# Altium project BLE_Gateway_V1.0.PrjPCB
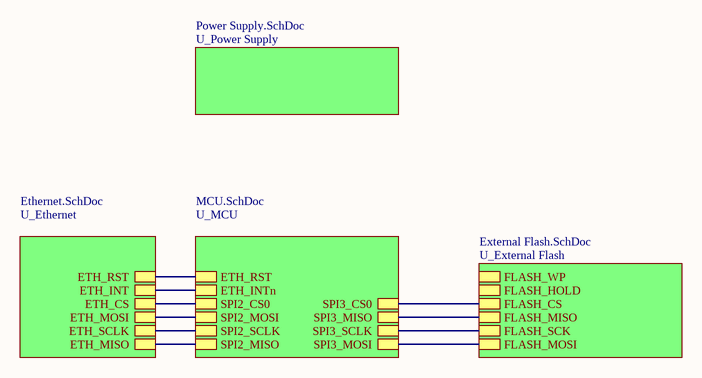
[diagram p0: Connection.SchDoc]
5 sheets, 108 parts. Net scope: hierarchical (ports join the sheet entries above them; power ports are global).
Board files: SHD2ZW2v1.2.1.PcbDoc, Logo.PcbDoc
Sheets:
  Connection.SchDoc
    U_MCU = MCU.SchDoc
    U_Ethernet = Ethernet.SchDoc
    U_Power Supply = Power Supply.SchDoc
    U_External Flash = External Flash.SchDoc

## Sheet Connection.SchDoc
size 381 x 241 mm

### Sub-sheets
U_Ethernet = Ethernet.SchDoc: ETH_MISO, ETH_MOSI, ETH_CS, ETH_INT, ETH_RST, ETH_SCLK
U_External Flash = External Flash.SchDoc: FLASH_CS, FLASH_MISO, FLASH_WP, FLASH_HOLD, FLASH_SCK, FLASH_MOSI
U_MCU = MCU.SchDoc: SPI3_MOSI, SPI3_MISO, SPI3_SCLK, SPI3_CS0, SPI2_CS0, SPI2_MOSI, SPI2_SCLK, SPI2_MISO, ETH_RST, ETH_INTn
U_Power Supply = Power Supply.SchDoc: no entries

### Nets
RSTn: sheet U_MCU/ETH_RST, sheet U_Ethernet/ETH_RST
SPI2_CS0: sheet U_MCU/SPI2_CS0, sheet U_Ethernet/ETH_CS
SPI2_MISO: sheet U_MCU/SPI2_MISO, sheet U_Ethernet/ETH_MISO
SPI2_MOSI: sheet U_MCU/SPI2_MOSI, sheet U_Ethernet/ETH_MOSI
SPI2_SCLK: sheet U_MCU/SPI2_SCLK, sheet U_Ethernet/ETH_SCLK
SPI3_CS0: sheet U_MCU/SPI3_CS0, sheet U_External Flash/FLASH_CS
SPI3_MISO: sheet U_MCU/SPI3_MISO, sheet U_External Flash/FLASH_MISO
SPI3_MOSI: sheet U_MCU/SPI3_MOSI, sheet U_External Flash/FLASH_MOSI
SPI3_SCLK: sheet U_MCU/SPI3_SCLK, sheet U_External Flash/FLASH_SCK
NetU2_11: sheet U_MCU/ETH_INTn, sheet U_Ethernet/ETH_INT

## Sheet MCU.SchDoc
size 304 x 241 mm
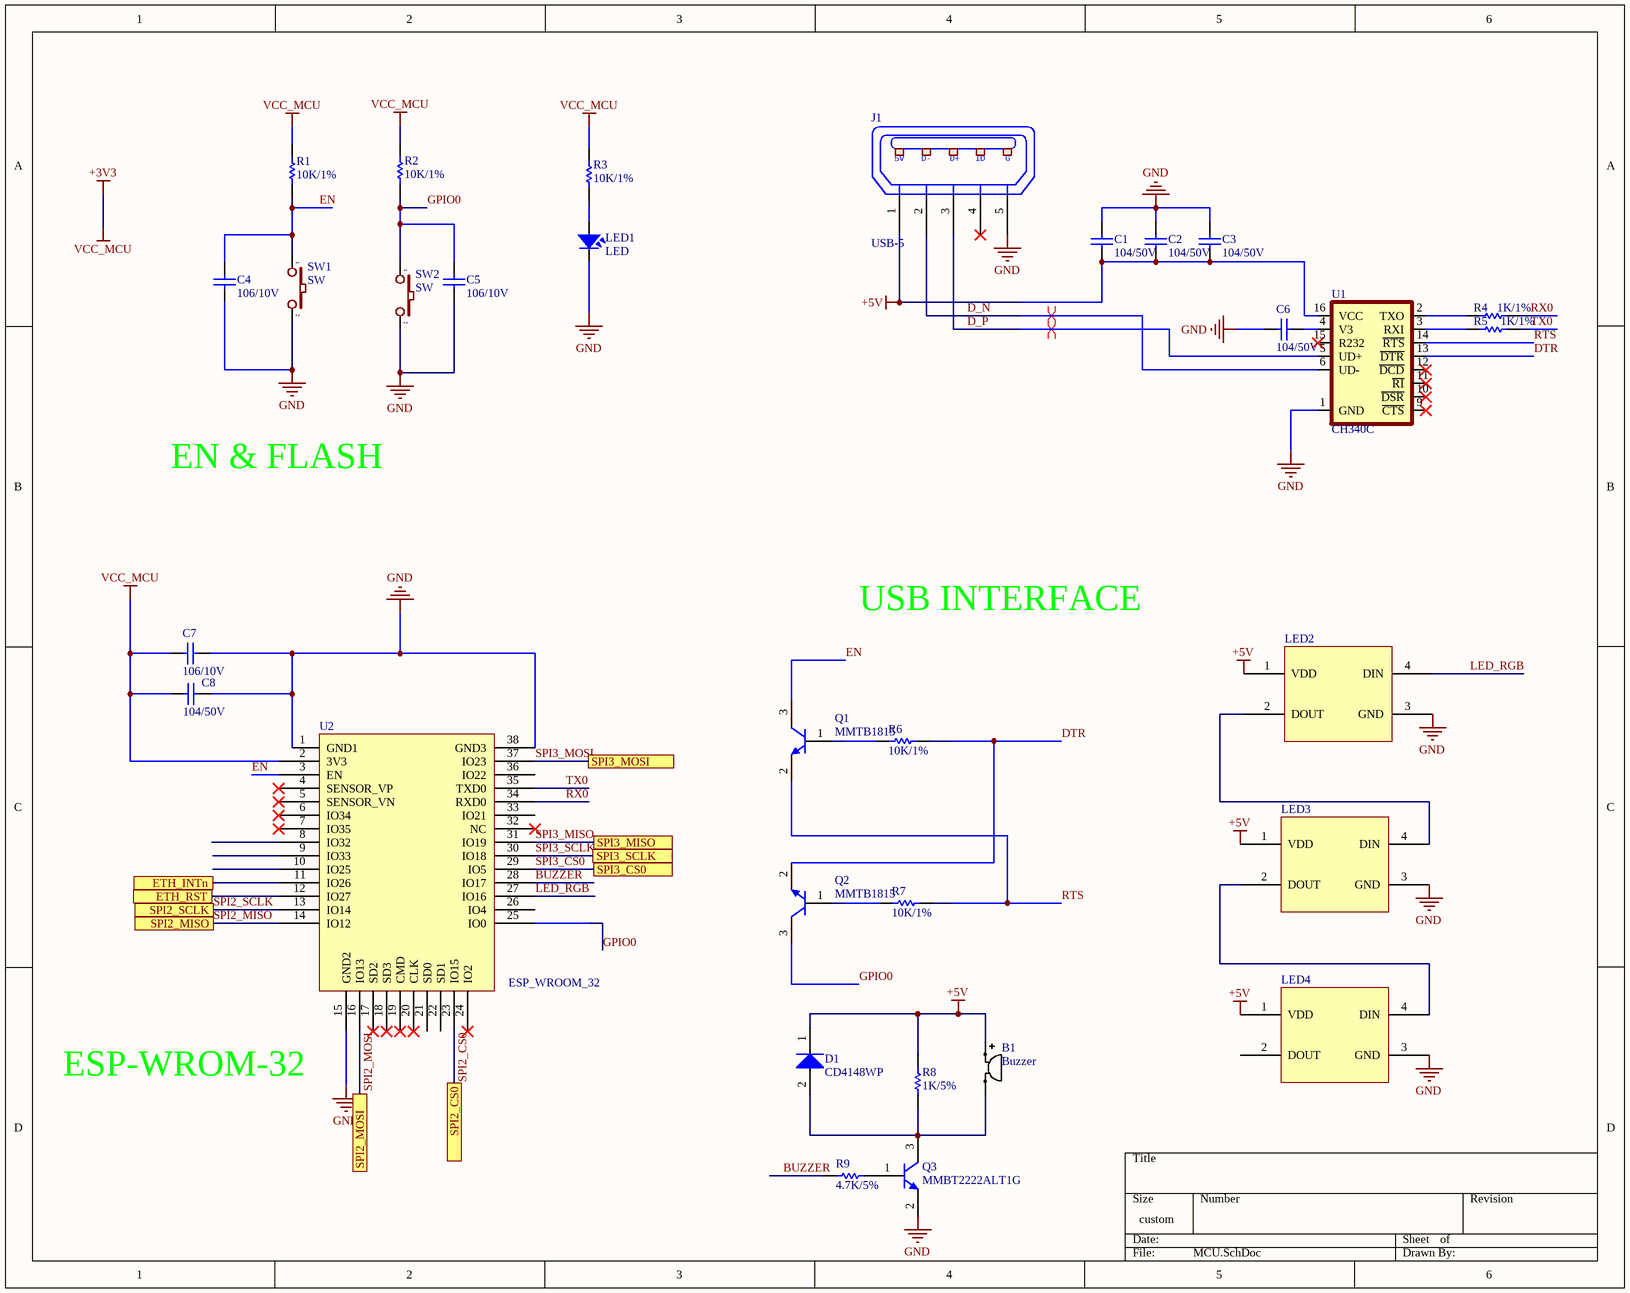
[diagram p1: MCU.SchDoc]

### Parts
B1  Buzzer  [PS1240P02BT]
C1  104/50V  [C0603-B]
C2  104/50V  [C0603-B]
C3  104/50V  [C0603-B]
C4  106/10V  [C0603-B]
C5  106/10V  [C0603-B]
C6  104/50V  [C0603-B]
C7  106/10V  [C0603-B]
C8  104/50V  [C0603-B]
D1  CD4148WP  [D1206-C]
J1  USB-5  [USB-M1]
LED1  LED  [LED-0805-Red]
LED2  RGB 4 Pin WS2812B  [WS2812B]  (value not drawn)
LED3  RGB 4 Pin WS2812B  [WS2812B]  (value not drawn)
LED4  RGB 4 Pin WS2812B  [WS2812B]  (value not drawn)
Q1  MMTB1815  [SOT23-321-C]
Q2  MMTB1815  [SOT23-321-C]
Q3  MMBT2222ALT1G  [SOT23-321-B]
R1  10K/1%  [R0603-B]
R2  10K/1%  [R0603-B]
R3  10K/1%  [R0603-B]
R4  1K/1%  [R0603-B]
R5  1K/1%  [R0603-B]
R6  10K/1%  [R0603-B]
R7  10K/1%  [R0603-B]
R8  1K/5%  [R0603-B]
R9  4.7K/5%  [R0603-B]
SW1  SW  [SW2 - 3x4x2.5]
SW2  SW  [SW2 - 3x4x2.5]
U1  CH340C  [SO016]
U2  ESP_WROOM_32  [ESP32_WROOM_32]

### Ports
ETH_INTn, ETH_RST, SPI2_CS0, SPI2_MISO, SPI2_MOSI, SPI2_SCLK, SPI3_CS0, SPI3_MISO, SPI3_MOSI, SPI3_SCLK

### Nets
+3V3: C7.2 C8.2 R1.2 R2.2 R3.2 U2.2(3V3)  [also labelled VCC_MCU]
+5V: B1.1 C1.1 C2.1 C3.1 D1.1(K) J1.1(P1) LED2.1(VDD) LED3.1(VDD) LED4.1(VDD) R8.2 U1.16(VCC)
GND: C1.2 C2.2 C3.2 C4.1 C5.1 C6.2 C7.1 C8.1 J1.5(P5) LED1.2 LED2.3(GND) LED3.3(GND) LED4.3(GND) Q3.2(E) SW1.2 SW2.2 U1.1(GND) U2.1(GND1) U2.15(GND2) U2.38(GND3)
BUZZER: R9.1 U2.28(IO17)
D_N: J1.2(P2) U1.6(UD-)
D_P: J1.3(P3) U1.5(UD+)
DTR: Q2.2(E) R6.2 U1.13(~{DTR})
EN: C4.2 Q1.3(C) R1.1 SW1.1 U2.3(EN)
GPIO0: C5.2 Q2.3(C) R2.1 SW2.1 U2.25(IO0)
LED_RGB: LED2.4(DIN) U2.27(IO16)
RSTn: U2.12(IO27) ; port ETH_RST
RTS: Q1.2(E) R7.2 U1.14(~{RTS})
RX0: R4.2 U2.34(RXD0)
SPI2_CS0: U2.23(IO15) ; port SPI2_CS0
SPI2_MISO: U2.14(IO12) ; port SPI2_MISO
SPI2_MOSI: U2.16(IO13) ; port SPI2_MOSI
SPI2_SCLK: U2.13(IO14) ; port SPI2_SCLK
SPI3_CS0: U2.29(IO5) ; port SPI3_CS0
SPI3_MISO: U2.31(IO19) ; port SPI3_MISO
SPI3_MOSI: U2.37(IO23) ; port SPI3_MOSI
SPI3_SCLK: U2.30(IO18) ; port SPI3_SCLK
TX0: R5.2 U2.35(TXD0)
NetB1_2: B1.2 D1.2(A) Q3.3(C) R8.1
NetC6_1: C6.1 U1.4(V3)
NetLED1_1: LED1.1 R3.1
NetLED2_2: LED2.2(DOUT) LED3.4(DIN)
NetLED3_2: LED3.2(DOUT) LED4.4(DIN)
NetQ1_1: Q1.1(B) R6.1
NetQ2_1: Q2.1(B) R7.1
NetQ3_1: Q3.1(B) R9.2
NetR4_1: R4.1 U1.2(TXO)
NetR5_1: R5.1 U1.3(RXI)
NetU2_11: U2.11(IO26) ; port ETH_INTn

Not connected (* = marked no-connect by the designer): J1 4(P4)*; LED4 2(DOUT); U1 9(~{CTS})* 10(~{DSR})* 11(~{RI})* 12(~{DCD})* 15(R232)*; U2 4(SENSOR_VP)* 5(SENSOR_VN)* 6(IO34)* 7(IO35)* 8(IO32) 9(IO33) 10(IO25) 17(SD2)* 18(SD3)* 19(CMD)* 20(CLK)* 21(SD0) 22(SD1) 24(IO2)* 26(IO4) 32(NC)* 33(IO21) 36(IO22)

### Layout directives
differential pair: D_N, D_P

### Notes on the sheet
- EN & FLASH
- USB INTERFACE
- ESP-WROM-32
- (in symbol USB-5) 5V; D-; D+; ID; G

### Library data of the parts
B1 = PS1240P02BT: Audio Indicators & Alerts Round 12.2mmx6.5mm 4kHz Vin=3V; BSH Partnumber: New part; Manufacture: TDK; Pricing (USD): 0.78; Partnumber: PS1240P02BT; Distributor: Digikey; Value: Buzzer; Creator: NamNHc; Date: 20170410; ComponentLink1Description: Datasheet; ComponentLink1URL: https://product.tdk.com/info/en/catalog/datasheets/ef532_ps.pdf; Datasheet: https://product.tdk.com/info/en/catalog/datasheets/ef532_ps.pdf; ComponentLink2Description: Link sale; ComponentLink2URL: https://www.digikey.com/product-detail/en/tdk-corporation/PS1240P02BT/445-2525-3-ND/935924; Link sale: https://www.digikey.com/product-detail/en/tdk-corporation/PS1240P02BT/445-2525-3-ND/935924
C1-C3 C6 C8 = CL10B104KB8NNNC: 100nF ±10% 50V X7R 0603 Multilayer Ceramic Capacitors MLCC - SMD/SMT RoHS; BSH Partnumber: C1591; Manufacture: Samsung Electro-Mechanics; Pricing (USD): 0.008; Partnumber: CL10B104KB8NNNC; Distributor: LCSC Electronics; Value: 104/50V; Creator: Digo; Date: 20210218; ComponentLink1Description: Datasheet; ComponentLink1URL: https://datasheet.lcsc.com/szlcsc/1811021431_Samsung-Electro-Mechanics-CL10B104KB8NNNC_C1591.pdf; Datasheet: https://datasheet.lcsc.com/szlcsc/1811021431_Samsung-Electro-Mechanics-CL10B104KB8NNNC_C1591.pdf; ComponentLink2Description: Link sale; ComponentLink2URL: https://item.szlcsc.com/1943.html; Link sale: https://item.szlcsc.com/1943.html
C4 C5 C7 = CL10A106KP8NNNC: 10uF ±10% 10V X5R 0603 Multilayer Ceramic Capacitors MLCC - SMD/SMT RoHS; BSH Partnumber: C19702; Manufacture: Samsung Electro-Mechanics; Pricing (USD): 0.008; Partnumber: CL10A106KP8NNNC; Distributor: LCSC Electronics; Value: 106/10V; Creator: Digo; Date: 20210219; ComponentLink1Description: Datasheet; ComponentLink1URL: https://datasheet.lcsc.com/szlcsc/1810191219_Samsung-Electro-Mechanics-CL10A106KP8NNNC_C19702.pdf; Datasheet: https://datasheet.lcsc.com/szlcsc/1810191219_Samsung-Electro-Mechanics-CL10A106KP8NNNC_C19702.pdf; ComponentLink2Description: Link sale; ComponentLink2URL: https://item.szlcsc.com/20411.html; Link sale: https://item.szlcsc.com/20411.html
D1 = CD4148WP: DIO D1206 150mA 75V Switching Chip Diode; BSH Partnumber: D-CD4148WP; Manufacture: Mayloon electronic; Pricing (USD): 0.029; Partnumber: CD4148WP; Value: CD4148WP; Creator: ChienNQ; Date: 20150818; ComponentLink1Description: Datasheet; ComponentLink1URL: http://www.mouser.com/ds/2/115/ds18004-73542.pdf; Datasheet: http://www.mouser.com/ds/2/115/ds18004-73542.pdf; ComponentLink2Description: Link sale; ComponentLink2URL: http://tme.vn/Product.aspx?id=1848; Link sale: http://tme.vn/Product.aspx?id=1848
J1 = USB-5: Manufacturer: FCI; Manufacturer Part Number: 10118193-0001LF; Connector Type: USB - micro B; Number of Contacts: 5; Gender: Receptacle; Specifications: USB 2.0; .Creator: MM; .Checked PCB: RF; Supplier 1: Digi-Key; RoHS: RoHS Compliant; Category: Connectors, Interconnects; Stock 1: 28642; Pricing 1: 1=0.46, 10=0.433, 25=0.3712, 50=0.3156, 100=0.3032, 250=0.27224, 500=0.25988 (USD); Packaging: Cut Tape (CT); Mounting Type: Surface Mount, Right Angle, Horizontal; Features: Shielded, Solder Retention; Ingress Protection: -; ComponentLink1URL: http://portal.fciconnect.com/Comergent//fci/drawing/10118193.pdf; ComponentLink1Description: http://portal.fciconnect.com/Comergent//fci/drawing/10118193.pdf; Supplier Part Number 1: 609-4616-1-ND; .Checked SCH: MM
LED1 = LED: LED Single colour Green and Red; Value: LED 3 ly Single Colour
LED2-LED4 = WS2812B: Intelligent control LED / integrated light source
Q1 Q2 = MMTB1815: Transistor NPN SOT23 MMTB1815 Pitch_0.90 mm 2.92x2.00x1.11 mm; BSH Partnumber: Q-MMBT1815-TP; Manufacture: Toshiba; Pricing (USD): 0.025; Partnumber: MMTB1815; Value: MMTB1815; Creator: DucNTc; Date: 20150912; ComponentLink1Description: Datasheet; ComponentLink1URL: http://www.cnelectr.net/diodes/pdf/mmbt1815.pdf; Datasheet: http://www.cnelectr.net/diodes/pdf/mmbt1815.pdf; ComponentLink2Description: Link sale; ComponentLink2URL: http://www.tme.vn/Product.aspx?id=413; Link sale: http://www.tme.vn/Product.aspx?id=413
Q3 = MMBT2222ALT1G: Transistor NPN SOT23 MMBT2222A Pitch_0.90 mm 2.92x2.00x1.11mm; BSH Partnumber: Q-MMBT2222A; Manufacture: Fairchild Semiconductor; Pricing (USD): 0.02; Partnumber: MMBT2222ALT1G; Distributor: Mouser; Value: MMBT2222ALT1G; Creator: SmartDevice; Date: 20150923; ComponentLink1Description: Datasheet; ComponentLink1URL: http://www.mouser.com/ds/2/308/MMBT2222LT1-D-80103.pdf; Datasheet: http://www.mouser.com/ds/2/308/MMBT2222LT1-D-80103.pdf; ComponentLink2Description: Link sale; ComponentLink2URL: http://www.mouser.vn/ProductDetail/ON-Semiconductor/MMBT2222ALT1G/?qs=sGAEpiMZZMutXGli8Ay4kC402l06AIhPIMD2ii7BaQ0%3d; Link sale: http://www.mouser.vn/ProductDetail/ON-Semiconductor/MMBT2222ALT1G/?qs=sGAEpiMZZMutXGli8Ay4kC402l06AIhPIMD2ii7BaQ0%3d
R1-R3 R6 R7 = RC0603FR-0710KL: RES 0603 10K 1% 100mW; BSH Partnumber: C98220; Manufacture: Yageo; Pricing (USD): 0.002; Partnumber: RC0603FR-0710KL; Distributor: LCSC Electronics; Value: 10K/1%; Creator: Digo; Date: 20181029; ComponentLink1Description: Datasheet; ComponentLink1URL: https://datasheet.lcsc.com/lcsc/1811101934_YAGEO-RC0603FR-0710KL_C98220.pdf; Datasheet: https://datasheet.lcsc.com/lcsc/1811101934_YAGEO-RC0603FR-0710KL_C98220.pdf; ComponentLink2Description: Link sale; ComponentLink2URL: https://item.szlcsc.com/99429.html; Link sale: https://item.szlcsc.com/99429.html
R4 R5 = RC0603FR-071KL: RES 0603 1K 1% 100mW; BSH Partnumber: R-1k-0603-1; Manufacture: Yageo; Pricing (USD): 0.002; Partnumber: RC0603FR-071KL; Distributor: Mouser; Value: 1K/1%; Creator: SmartDevice; Date: 20150818; ComponentLink1Description: Datasheet; ComponentLink1URL: http://www.mouser.com/ds/2/447/RC0603-272842.pdf; Datasheet: http://www.mouser.com/ds/2/447/RC0603-272842.pdf; ComponentLink2Description: Link sale; ComponentLink2URL: http://vn.mouser.com/ProductDetail/Yageo/RC0603FR-071KL/?qs=%2fha2pyFaduhXXNW8qwNUNqQ9kEEY7HXXvpzZHS3Y0h%2feQEDxZMSpaQ%3d%3d; Link sale: http://vn.mouser.com/ProductDetail/Yageo/RC0603FR-071KL/?qs=%2fha2pyFaduhXXNW8qwNUNqQ9kEEY7HXXvpzZHS3Y0h%2feQEDxZMSpaQ%3d%3d
R8 = RC0603JR-071KL: RES 0603 1K 5% 100mW; BSH Partnumber: R-1K-0603-5; Manufacture: Yageo; Pricing (USD): 0.002; Partnumber: RC0603JR-071KL; Distributor: Mouser; Value: 1K/5%; Creator: SmartDevice; Date: 20160721; ComponentLink1Description: Datasheet; ComponentLink1URL: http://www.mouser.com/ds/2/447/RC0603-272842.pdf; Datasheet: http://www.mouser.com/ds/2/447/RC0603-272842.pdf; ComponentLink2Description: Link sale; ComponentLink2URL: http://www.mouser.vn/ProductDetail/Yageo/RC0603JR-071KL/?qs=%2fha2pyFaduiI%252b%2f%2fp%2fYhTTYiezRJ8nHxshEHwOaiSZf9t3tyz6IYSbg%3d%3d; Link sale: http://www.mouser.vn/ProductDetail/Yageo/RC0603JR-071KL/?qs=%2fha2pyFaduiI%252b%2f%2fp%2fYhTTYiezRJ8nHxshEHwOaiSZf9t3tyz6IYSbg%3d%3d
R9 = RC0603JR-074K7L: RES 0603 4K7 5% 100mW; BSH Partnumber: R-4K7-0603-5; Manufacture: Yageo; Pricing (USD): 0.002; Partnumber: RC0603JR-074K7L; Distributor: Mouser; Value: 4.7K/5%; Creator: SmartDevice; Date: 20150818; ComponentLink1Description: Datasheet; ComponentLink1URL: http://www.mouser.com/ds/2/447/RC0603-272842.pdf; Datasheet: http://www.mouser.com/ds/2/447/RC0603-272842.pdf; ComponentLink2Description: Link sale; ComponentLink2URL: http://vn.mouser.com/ProductDetail/Yageo/RC0603JR-074K7L/?qs=sGAEpiMZZMu61qfTUdNhG5eFuApKbqVdnRFv6b%2fvKA4%3d; Link sale: http://vn.mouser.com/ProductDetail/Yageo/RC0603JR-074K7L/?qs=sGAEpiMZZMu61qfTUdNhG5eFuApKbqVdnRFv6b%2fvKA4%3d
SW1 SW2 = SW2: Switch button 2 pin; Value: SW chip 2 pin
U1 = CH340C: USB to serial chip CH340; MF: WCH; Package: Package; Check_prices: https://www.snapeda.com/parts/CH340C/WCH/view-part/5428851/?ref=eda; Value: *; Price: None; MP: CH340C; Availability: Unavailable; SnapEDA_Link: https://www.snapeda.com/parts/CH340C/WCH/view-part/5428851/?ref=snap; ComponentLink1Description: https://shopee.vn/10-Ic-Ch340C-Ch340-Sop-16-Ic-Ch%E1%BA%A5t-L%C6%B0%E1%BB%A3ng-Cao-i.354017206.3568923182?gclid=CjwKCAjwgviIBhBkEiwA10D2jxg9RuL2f9hWoYHeo_FSM6pspJ3WHd-aH4B39ByWSgvqeA63UJxyaRoCPFwQAvD_BwE; ComponentLink1URL: https://shopee.vn/10-Ic-Ch340C-Ch340-Sop-16-Ic-Ch%E1%BA%A5t-L%C6%B0%E1%BB%A3ng-Cao-i.354017206.3568923182?gclid=CjwKCAjwgviIBhBkEiwA10D2jxg9RuL2f9hWoYHeo_FSM6pspJ3WHd-aH4B39ByWSgvqeA63UJxyaRoCPFwQAvD_BwE; ComponentLink2Description: https://shopee.vn/IC-giao-ti%E1%BA%BFp-USB-UART-CH340C-i.211729822.6315362497; ComponentLink2URL: https://shopee.vn/IC-giao-ti%E1%BA%BFp-USB-UART-CH340C-i.211729822.6315362497
U2 = ESP_WROOM_32: Manufacturer: Espressif Systems; Manufacturer Part Number: ESP32-WROOM-32E(4MBHIGHTEMP); Supplier 1: Digi-Key; Stock 1: 0; Pricing 1: 1=3.15 (USD); Supplier Part Number 1: 1965-ESP32-WROOM-32E(4MBHIGHTEMP)CT-ND; ComponentLink1Description: https://banlinhkien.vn/goods-9735-esp32-wroom-32-esp32-soc-chinh-hang.html; ComponentLink1URL: https://banlinhkien.vn/goods-9735-esp32-wroom-32-esp32-soc-chinh-hang.html

## Sheet Ethernet.SchDoc
size 381 x 241 mm
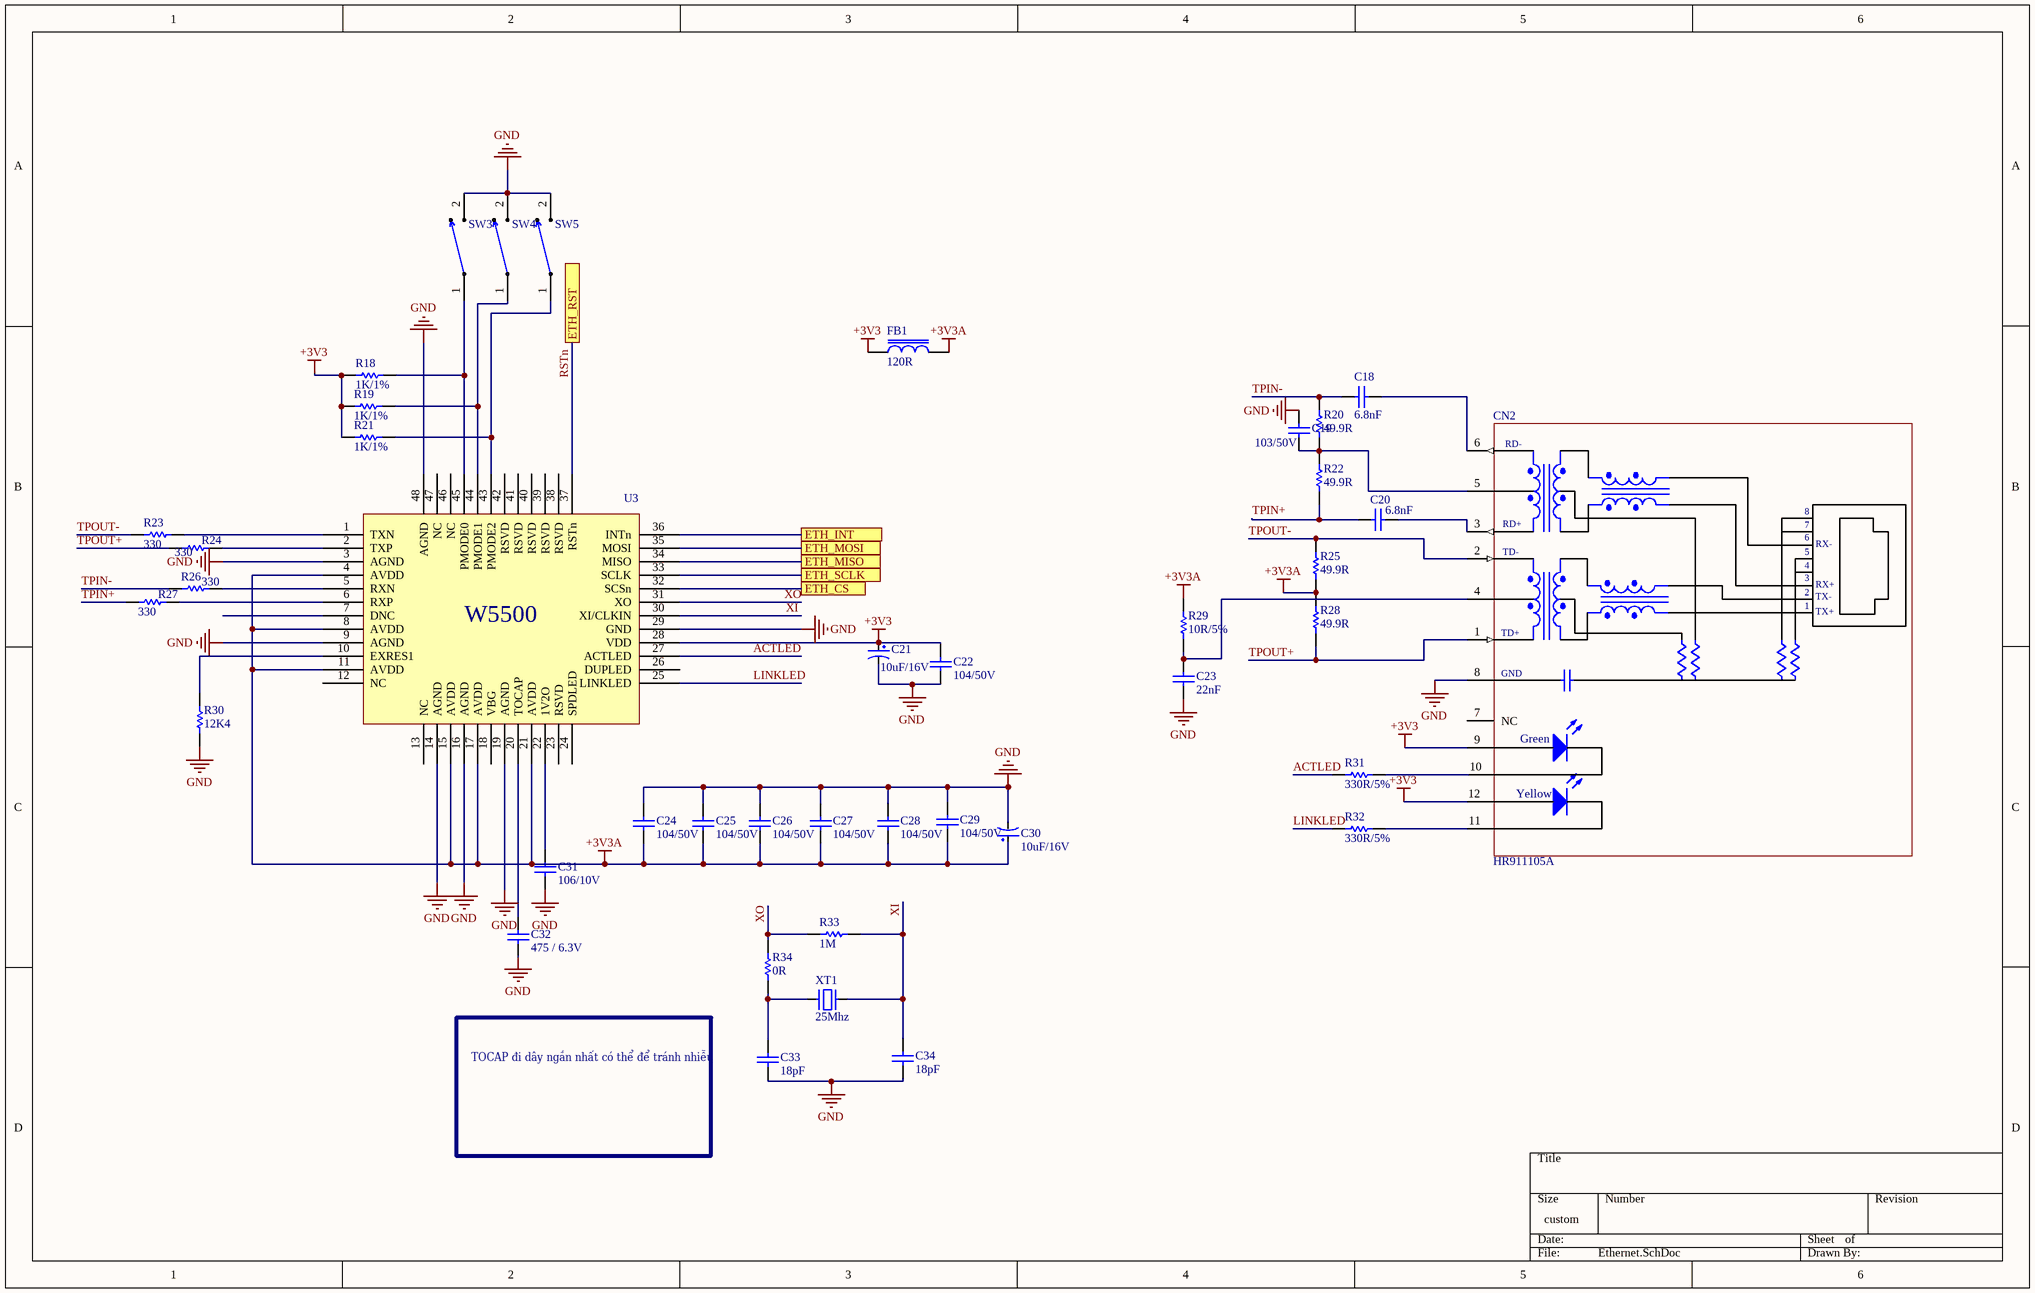
[diagram p2: Ethernet.SchDoc]

### Parts
C18  6.8nF  [C0603-B]
C19  103/50V  [C0603-B]
C20  6.8nF  [C0603-B]
C21  10uF/16V  [CAP_3216]
C22  104/50V  [C0603-B]
C23  22nF  [C0603-B]
C24  104/50V  [C0603-B]
C25  104/50V  [C0603-B]
C26  104/50V  [C0603-B]
C27  104/50V  [C0603-B]
C28  104/50V  [C0603-B]
C29  104/50V  [C0603-B]
C30  10uF/16V  [CAP_3216]
C31  106/10V  [C0603-B]
C32  475 / 6.3V  [C0603-B]
C33  18pF  [C0603-B]
C34  18pF  [C0603-B]
CN2  HR911105A  [HR911105A]
FB1  120R  [FB0805-B]
R18  1K/1%  [R0603-B]
R19  1K/1%  [R0603-B]
R20  49.9R  [R0603-B]
R21  1K/1%  [R0603-B]
R22  49.9R  [R0603-B]
R23  330  [R0603-B]
R24  330  [R0603-B]
R25  49.9R  [R0603-B]
R26  330  [R0603-B]
R27  330  [R0603-B]
R28  49.9R  [R0603-B]
R29  10R/5%  [R0603-B]
R30  12K4  [R0603-B]
R31  330R/5%  [R0603-B]
R32  330R/5%  [R0603-B]
R33  1M  [R0603-B]
R34  0R  [R0603-B]
SW3  Switch NO  [SW0.5 NO]  (value not drawn)
SW4  Switch NO  [SW0.5 NO]  (value not drawn)
SW5  Switch NO  [SW0.5 NO]  (value not drawn)
U3  W5500  [LQFP 48]  (value not drawn)
XT1  25Mhz  [XTAL-RU49/4]

### Ports
ETH_CS, ETH_INT, ETH_MISO, ETH_MOSI, ETH_RST, ETH_SCLK

### Nets
+3V3: C21.1 C22.2 CN2.9 CN2.12 FB1.1 R18.1 R19.1 R21.1 U3.28(VDD)
+3V3A: C24.1 C25.1 C26.1 C27.1 C28.1 C29.1 C30.1 FB1.2 R25.2 R28.1 R29.2 U3.4(AVDD) U3.8(AVDD) U3.11(AVDD) U3.15(AVDD) U3.17(AVDD) U3.21(AVDD)
GND: C19.2 C21.2 C22.1 C23.1 C24.2 C25.2 C26.2 C27.2 C28.2 C29.2 C30.2 C31.1 C32.1 C33.1 C34.1 CN2.8(GND) R30.1 SW3.2 SW4.2 SW5.2 U3.3(AGND) U3.9(AGND) U3.14(AGND) U3.16(AGND) U3.19(AGND) U3.29(GND) U3.48(AGND)
ACTLED: R31.1 U3.27(ACTLED)
LINKLED: R32.1 U3.25(LINKLED)
RSTn: U3.37(RSTn) ; port ETH_RST
SPI2_CS0: U3.32(SCSn) ; port ETH_CS
SPI2_MISO: U3.34(MISO) ; port ETH_MISO
SPI2_MOSI: U3.35(MOSI) ; port ETH_MOSI
SPI2_SCLK: U3.33(SCLK) ; port ETH_SCLK
TPIN+: C20.1 R22.2 R27.1
TPIN-: C18.1 R20.1 R26.1
TPOUT+: CN2.1(TD+) R24.1 R28.2
TPOUT-: CN2.2(TD-) R23.1 R25.1
XI: C34.2 R33.1 U3.30(XI/CLKIN) XT1.2
XO: R33.2 R34.2 U3.31(XO)
NetC18_2: C18.2 CN2.6(RD-)
NetC19_1: C19.1 CN2.5 R20.2 R22.1
NetC20_2: C20.2 CN2.3(RD+)
NetC23_2: C23.2 CN2.4 R29.1
NetC31_2: C31.2 U3.22(1V2O)
NetC32_2: C32.2 U3.20(TOCAP)
NetC33_2: C33.2 R34.1 XT1.1
NetCN2_10: CN2.10 R31.2
NetCN2_11: CN2.11 R32.2
NetR18_2: R18.2 SW3.1 U3.45(PMODE0)
NetR19_2: R19.2 SW4.1 U3.44(PMODE1)
NetR21_2: R21.2 SW5.1 U3.43(PMODE2)
NetR23_2: R23.2 U3.1(TXN)
NetR24_2: R24.2 U3.2(TXP)
NetR26_2: R26.2 U3.5(RXN)
NetR27_2: R27.2 U3.6(RXP)
NetR30_2: R30.2 U3.10(EXRES1)
NetU2_11: U3.36(INTn) ; port ETH_INT

Not connected (* = marked no-connect by the designer): CN2 7(NC); U3 7(DNC) 12(NC) 13(NC) 18(VBG) 23(RSVD) 24(SPDLED) 26(DUPLED) 38(RSVD) 39(RSVD) 40(RSVD) 41(RSVD) 42(RSVD) 46(NC) 47(NC)

### Notes on the sheet
- (near C33) TOCAP đi dây ngắn nhất có thể để tránh nhiễu
- (in symbol HR911105A) RX-; RX+; TX-; TX+; Green; Yellow

### Library data of the parts
C18 C20 = CL10B683KB8NNNC: 50V 68nF X7R ±10% 0603 Multilayer Ceramic Capacitors MLCC - SMD/SMT ROHS; BSH Partnumber: C31658; Manufacture: Samsung Electro-Mechanics; Value: 683/50V; Pricing (USD): 0.008; Partnumber: CL10B683KB8NNNC; Distributor: LCSC Electronics; Creator: Digo; Date: 20220127; ComponentLink1Description: Datasheet; ComponentLink1URL: https://item.szlcsc.com/32617.html; Datasheet: https://item.szlcsc.com/32617.html; ComponentLink2Description: Link sale; ComponentLink2URL: https://datasheet.lcsc.com/lcsc/1811072020_Samsung-Electro-Mechanics-CL10B683KB8NNNC_C31658.pdf; Link sale: https://datasheet.lcsc.com/lcsc/1811072020_Samsung-Electro-Mechanics-CL10B683KB8NNNC_C31658.pdf
C19 = CL10B103KB8NNNC: 10nF ±10% 50V X7R 0603 Multilayer Ceramic Capacitors MLCC - SMD/SMT RoHS; BSH Partnumber: C1589; Manufacture: Samsung Electro-Mechanics; Pricing (USD): 0.008; Partnumber: CL10B103KB8NNNC; Distributor: LCSC Electronics; Value: 103/50V; Creator: Digo; Date: 20210222; ComponentLink1Description: Datasheet; ComponentLink1URL: https://datasheet.lcsc.com/szlcsc/1810191222_Samsung-Electro-Mechanics-CL10B103KB8NNNC_C1589.pdf; Datasheet: https://datasheet.lcsc.com/szlcsc/1810191222_Samsung-Electro-Mechanics-CL10B103KB8NNNC_C1589.pdf; ComponentLink2Description: Link sale; ComponentLink2URL: https://lcsc.com/product-detail/Multilayer-Ceramic-Capacitors-MLCC-SMD-SMT_Samsung-Electro-Mechanics-CL10B103KB8NNNC_C1589.htmlhttps://lcsc.com/product-detail/Multilayer-Ceramic-Capacitors-MLCC-SMD-SMT_Samsung-Electro-Mechanics-CL10B103KB8NNNC_C1589.html; Link sale: https://lcsc.com/product-detail/Multilayer-Ceramic-Capacitors-MLCC-SMD-SMT_Samsung-Electro-Mechanics-CL10B103KB8NNNC_C1589.htmlhttps://lcsc.com/product-detail/Multilayer-Ceramic-Capacitors-MLCC-SMD-SMT_Samsung-Electro-Mechanics-CL10B103KB8NNNC_C1589.html
C21 C30 = CAP-ALU-SMD: Polarized Capacitor (Axial); Published: 8-Jun-2000; LatestRevisionDate: 17-Jul-2002; LatestRevisionNote: Re-released for DXP Platform.; PackageReference: POLAR0.8; Publisher: Altium Limited
C22 C24-C29 = CL10B104KB8NNNC: as C1 on sheet MCU; Partnumber: CL10B104KB8NNNC; Distributor: LCSC Electronics; Value: 104/50V; Creator: Digo; Date: 20210218; ComponentLink1Description: Datasheet; ComponentLink1URL: https://datasheet.lcsc.com/szlcsc/1811021431_Samsung-Electro-Mechanics-CL10B104KB8NNNC_C1591.pdf; Datasheet: https://datasheet.lcsc.com/szlcsc/1811021431_Samsung-Electro-Mechanics-CL10B104KB8NNNC_C1591.pdf; ComponentLink2Description: Link sale; ComponentLink2URL: https://item.szlcsc.com/1943.html; Link sale: https://item.szlcsc.com/1943.html
C23 = CL10B222KB8NNNC: 2.2nF ±10% 50V X7R 0603 Multilayer Ceramic Capacitors MLCC - SMD/SMT RoHS; BSH Partnumber: C16033; Manufacture: Samsung Electro-Mechanics; Value: 222/50V; Pricing (USD): 0.008; Partnumber: CL10B222KB8NNNC; Distributor: LCSC Electronics; Creator: Digo; Date: 20210222; ComponentLink1Description: Datasheet; ComponentLink1URL: https://datasheet.lcsc.com/szlcsc/1810261512_Samsung-Electro-Mechanics-CL10B222KB8NNNC_C16033.pdf; Datasheet: https://datasheet.lcsc.com/szlcsc/1810261512_Samsung-Electro-Mechanics-CL10B222KB8NNNC_C16033.pdf; ComponentLink2Description: Link sale; ComponentLink2URL: https://lcsc.com/product-detail/Multilayer-Ceramic-Capacitors-MLCC-SMD-SMT_SAMSUNG_CL10B222KB8NNNC_2-2nF-222-10-50V_C16033.html; Link sale: https://lcsc.com/product-detail/Multilayer-Ceramic-Capacitors-MLCC-SMD-SMT_SAMSUNG_CL10B222KB8NNNC_2-2nF-222-10-50V_C16033.html
C31 = CL10A106KP8NNNC: as C4 on sheet MCU; Partnumber: CL10A106KP8NNNC; Distributor: LCSC Electronics; Value: 106/10V; Creator: Digo; Date: 20210219; ComponentLink1Description: Datasheet; ComponentLink1URL: https://datasheet.lcsc.com/szlcsc/1810191219_Samsung-Electro-Mechanics-CL10A106KP8NNNC_C19702.pdf; Datasheet: https://datasheet.lcsc.com/szlcsc/1810191219_Samsung-Electro-Mechanics-CL10A106KP8NNNC_C19702.pdf; ComponentLink2Description: Link sale; ComponentLink2URL: https://item.szlcsc.com/20411.html; Link sale: https://item.szlcsc.com/20411.html
C32 = CL10A475MQ8NNNC: Multilayer Ceramic Capacitors MLCC - SMD/SMT 4.7uF+/-20% 6.3V X5R 1608; BSH Partnumber: New part; Manufacture: Samsung Electro-Mechanics; Pricing (USD): 0.008; Partnumber: CL10A475MQ8NNNC; Value: 475 / 6.3V; Creator: NamNH; Date: 20201215; ComponentLink1Description: Datasheet; ComponentLink1URL: https://www.mouser.vn/datasheet/2/585/MLCC-1837944.pdf; Datasheet: https://www.mouser.vn/datasheet/2/585/MLCC-1837944.pdf; ComponentLink2Description: Link sale; ComponentLink2URL: https://www.mouser.vn/ProductDetail/Samsung-Electro-Mechanics/CL10A475MQ8NNNC/?qs=X6jEic%2FHinBqyUv6Rpt3UA%3D%3D; Link sale: https://www.mouser.vn/ProductDetail/Samsung-Electro-Mechanics/CL10A475MQ8NNNC/?qs=X6jEic%2FHinBqyUv6Rpt3UA%3D%3D
C33 C34 = CL10A106KP8NNNC: 10uF ±10% 10V X5R 0603 Multilayer Ceramic Capacitors MLCC - SMD/SMT RoHS; BSH Partnumber: C19702; Manufacture: Samsung Electro-Mechanics; Value: 106/10V; Pricing (USD): 0.008; Partnumber: CL10A106KP8NNNC; Distributor: LCSC Electronics; Creator: Digo; Date: 20210219; ComponentLink1Description: Datasheet; ComponentLink1URL: https://datasheet.lcsc.com/szlcsc/1810191219_Samsung-Electro-Mechanics-CL10A106KP8NNNC_C19702.pdf; Datasheet: https://datasheet.lcsc.com/szlcsc/1810191219_Samsung-Electro-Mechanics-CL10A106KP8NNNC_C19702.pdf; ComponentLink2Description: Link sale; ComponentLink2URL: https://item.szlcsc.com/20411.html; Link sale: https://item.szlcsc.com/20411.html
CN2 = HR911105A: CON  RJ45  with Magnetics & LED; BSH Partnumber: CN-HR911105A; Manufacture: HanRun; Pricing (USD): 1.19; Partnumber: HR911105A; Value: HR911105A; Creator: ChienNQ; Date: 20150818; ComponentLink1Description: Datasheet; ComponentLink1URL: http://www.tme.vn/upload/pdf/HR911105A.pdf; Datasheet: http://www.tme.vn/upload/pdf/HR911105A.pdf; ComponentLink2Description: Link sale; ComponentLink2URL: http://www.mouser.com/ProductDetail/ALPS/SCHA5B0200/?qs=YMSFtX0bdJBJ9BVESQTYvg%3D%3D; Link sale: http://www.mouser.com/ProductDetail/ALPS/SCHA5B0200/?qs=YMSFtX0bdJBJ9BVESQTYvg%3D%3D
FB1 = CBW201209U301T: 2A 1 200mΩ 300Ω 100MHz 0805 Ferrite Beads ROHS; BSH Partnumber: C67451; Manufacture: FH; Value: 300 Ohms; Pricing (USD): 0.032; Partnumber: CBW201209U301T; Distributor: LCSC Electronics; Creator: Digo; Date: 20211109; ComponentLink1Description: Datasheet; ComponentLink1URL: https://datasheet.lcsc.com/lcsc/1811061723_FH-Guangdong-Fenghua-Advanced-Tech-CBW201209U301T_C67451.pdf; Datasheet: https://datasheet.lcsc.com/lcsc/1811061723_FH-Guangdong-Fenghua-Advanced-Tech-CBW201209U301T_C67451.pdf; ComponentLink2Description: Link sale; ComponentLink2URL: https://item.szlcsc.com/68546.html; Link sale: https://item.szlcsc.com/68546.html
R18 R19 R21 = RC0603FR-071KL: as R4 on sheet MCU; Partnumber: RC0603FR-071KL; Distributor: Mouser; Value: 1K/1%; Creator: SmartDevice; Date: 20150818; ComponentLink1Description: Datasheet; ComponentLink1URL: http://www.mouser.com/ds/2/447/RC0603-272842.pdf; Datasheet: http://www.mouser.com/ds/2/447/RC0603-272842.pdf; ComponentLink2Description: Link sale; ComponentLink2URL: http://vn.mouser.com/ProductDetail/Yageo/RC0603FR-071KL/?qs=%2fha2pyFaduhXXNW8qwNUNqQ9kEEY7HXXvpzZHS3Y0h%2feQEDxZMSpaQ%3d%3d; Link sale: http://vn.mouser.com/ProductDetail/Yageo/RC0603FR-071KL/?qs=%2fha2pyFaduhXXNW8qwNUNqQ9kEEY7HXXvpzZHS3Y0h%2feQEDxZMSpaQ%3d%3d
R20 R22 R25 R28 = RC0603FR-0710KL: RES 0603 10K 1% 100mW; BSH Partnumber: C98220; Manufacture: Yageo; Value: 10K/1%; Pricing (USD): 0.002; Partnumber: RC0603FR-0710KL; Distributor: LCSC Electronics; Creator: Digo; Date: 20181029; ComponentLink1Description: Datasheet; ComponentLink1URL: https://datasheet.lcsc.com/lcsc/1811101934_YAGEO-RC0603FR-0710KL_C98220.pdf; Datasheet: https://datasheet.lcsc.com/lcsc/1811101934_YAGEO-RC0603FR-0710KL_C98220.pdf; ComponentLink2Description: Link sale; ComponentLink2URL: https://item.szlcsc.com/99429.html; Link sale: https://item.szlcsc.com/99429.html
R23 R24 R26 R27 = RC0603JR-0733RL: RES 0603 33R 5% 100mW; BSH Partnumber: R-33R-0603-5; Manufacture: Yageo; Pricing (USD): 0.002; Partnumber: RC0603JR-0733RL; Value: 330; Creator: ChienNQ; Date: 20150818; ComponentLink1Description: Datasheet; ComponentLink1URL: http://www.mouser.com/ds/2/447/RC0603-272842.pdf; Datasheet: http://www.mouser.com/ds/2/447/RC0603-272842.pdf; ComponentLink2Description: Link sale; ComponentLink2URL: http://vn.mouser.com/ProductDetail/Yageo/RC0603JR-0733RL/?qs=%2fha2pyFaduiI%252b%2f%2fp%2fYhTTdPtw1Ix8qdvSFVlr4feI0MvuVkMxYqj1w%3d%3d; Link sale: http://vn.mouser.com/ProductDetail/Yageo/RC0603JR-0733RL/?qs=%2fha2pyFaduiI%252b%2f%2fp%2fYhTTdPtw1Ix8qdvSFVlr4feI0MvuVkMxYqj1w%3d%3d
R29 = RC0603JR-0710RL: RES 0603 10R 5% 100mW; BSH Partnumber: C109317; Manufacture: Yageo; Pricing (USD): 0.002; Partnumber: RC0603JR-0710RL; Distributor: LCSC Electronics; Value: 10R/5%; Creator: Digo; Date: 20150818; ComponentLink1Description: Datasheet; ComponentLink1URL: https://datasheet.lcsc.com/lcsc/1810010232_YAGEO-RC0603JR-0710RL_C109317.pdf; Datasheet: https://datasheet.lcsc.com/lcsc/1810010232_YAGEO-RC0603JR-0710RL_C109317.pdf; ComponentLink2Description: Link sale; ComponentLink2URL: https://item.szlcsc.com/110538.html; Link sale: https://item.szlcsc.com/110538.html
R30 = RC0603FR-0712K4L: RES 0603 12.4K 1% 100mW; BSH Partnumber: R-12K4-0603-1; Manufacture: Yageo; Pricing (USD): 0.002; Partnumber: RC0603FR-0712K4L; Value: 12K4; Creator: ChienNQ; Date: 20150818; ComponentLink1Description: Datasheet; ComponentLink1URL: http://www.mouser.com/ds/2/447/RC0603-272842.pdf; Datasheet: http://www.mouser.com/ds/2/447/RC0603-272842.pdf; ComponentLink2Description: Link sale; ComponentLink2URL: http://vn.mouser.com/ProductDetail/Yageo/RC0603FR-0712K4L/?qs=%2fha2pyFaduhXXNW8qwNUNtQbIe9NkWgBBZ6AkwbdyUcbVAv%2f5NVMmA%3d%3d; Link sale: http://vn.mouser.com/ProductDetail/Yageo/RC0603FR-0712K4L/?qs=%2fha2pyFaduhXXNW8qwNUNtQbIe9NkWgBBZ6AkwbdyUcbVAv%2f5NVMmA%3d%3d
R31 R32 = RC0603JR-07330RL: RES 0603 330R 5% 100mW; BSH Partnumber: R-330R-0603-5; Manufacture: Yageo; Pricing (USD): 0.002; Partnumber: RC0603JR-07330RL; Distributor: Mouser; Value: 330R/5%; Creator: SmartDevice; Date: 20150818; ComponentLink1Description: Datasheet; ComponentLink1URL: http://www.mouser.com/ds/2/447/RC0603-272842.pdf; Datasheet: http://www.mouser.com/ds/2/447/RC0603-272842.pdf; ComponentLink2Description: Link sale; ComponentLink2URL: http://vn.mouser.com/ProductDetail/Yageo/RC0603JR-07330RL/?qs=sGAEpiMZZMu61qfTUdNhG0fejjHH2KXS1w8pBW1iJYA%3d; Link sale: http://vn.mouser.com/ProductDetail/Yageo/RC0603JR-07330RL/?qs=sGAEpiMZZMu61qfTUdNhG0fejjHH2KXS1w8pBW1iJYA%3d
R33 = RC0603JR-072ML: RES 0603 2M 5% 100mW; BSH Partnumber: R-2M-0603-5; Manufacture: Yageo; Value: 2M/5%; Pricing (USD): 0.002; Partnumber: RC0603JR-072ML; Distributor: Mouser; Creator: NamNHc; Date: 20170605; ComponentLink1Description: Datasheet; ComponentLink1URL: http://www.yageo.com.tw/exep/pages/download/literatures/PYu-R_INT-thick_7.pdf; Datasheet: http://www.yageo.com.tw/exep/pages/download/literatures/PYu-R_INT-thick_7.pdf; ComponentLink2Description: Link sale; ComponentLink2URL: https://www.digikey.com/product-detail/en/yageo/RC0603JR-072ML/311-2.0MGRCT-ND/729674; Link sale: https://www.digikey.com/product-detail/en/yageo/RC0603JR-072ML/311-2.0MGRCT-ND/729674
R34 = RC0603JR-070RL: RES 0603 0R 5% 100mW; BSH Partnumber: C95177; Manufacture: Yageo; Pricing (USD): 0.002; Partnumber: RC0603JR-070RL; Distributor: LCSC Electronics; Value: 0R; Creator: Digo; Date: 20160716; ComponentLink1Description: Datasheet; ComponentLink1URL: https://datasheet.lcsc.com/lcsc/1809281528_YAGEO-RC0603JR-070RL_C95177.pdf; Datasheet: https://datasheet.lcsc.com/lcsc/1809281528_YAGEO-RC0603JR-070RL_C95177.pdf; ComponentLink2Description: Link sale; ComponentLink2URL: https://item.szlcsc.com/96378.html; Link sale: https://item.szlcsc.com/96378.html
SW3-SW5 = PCB Switch NO: BSH Partnumber: New part; Manufacture: Wething; Pricing (USD): 0.32; Partnumber: PCB Switch NO; Distributor: Mouser; Creator: NamNH; Date: 20201009; ComponentLink1Description: Datasheet; ComponentLink2Description: Link sale
U3 = W5500: Hardwired TCP/IP embedded Ethernet controller that provides / easier Internet connection to embedded systems
XT1 = XT2_1: CRYSTAL 12.0000MHZ 18PF SMD; Manufacturer: IQD Frequency Products; Part number: LFXTAL036356REEL; Value: 12Mhz; Category: Crystals; Package: HC-49/US; User_Description: CRYSTAL 12.0000MHZ 18PF SMD

## Sheet Power Supply.SchDoc
size 381 x 241 mm
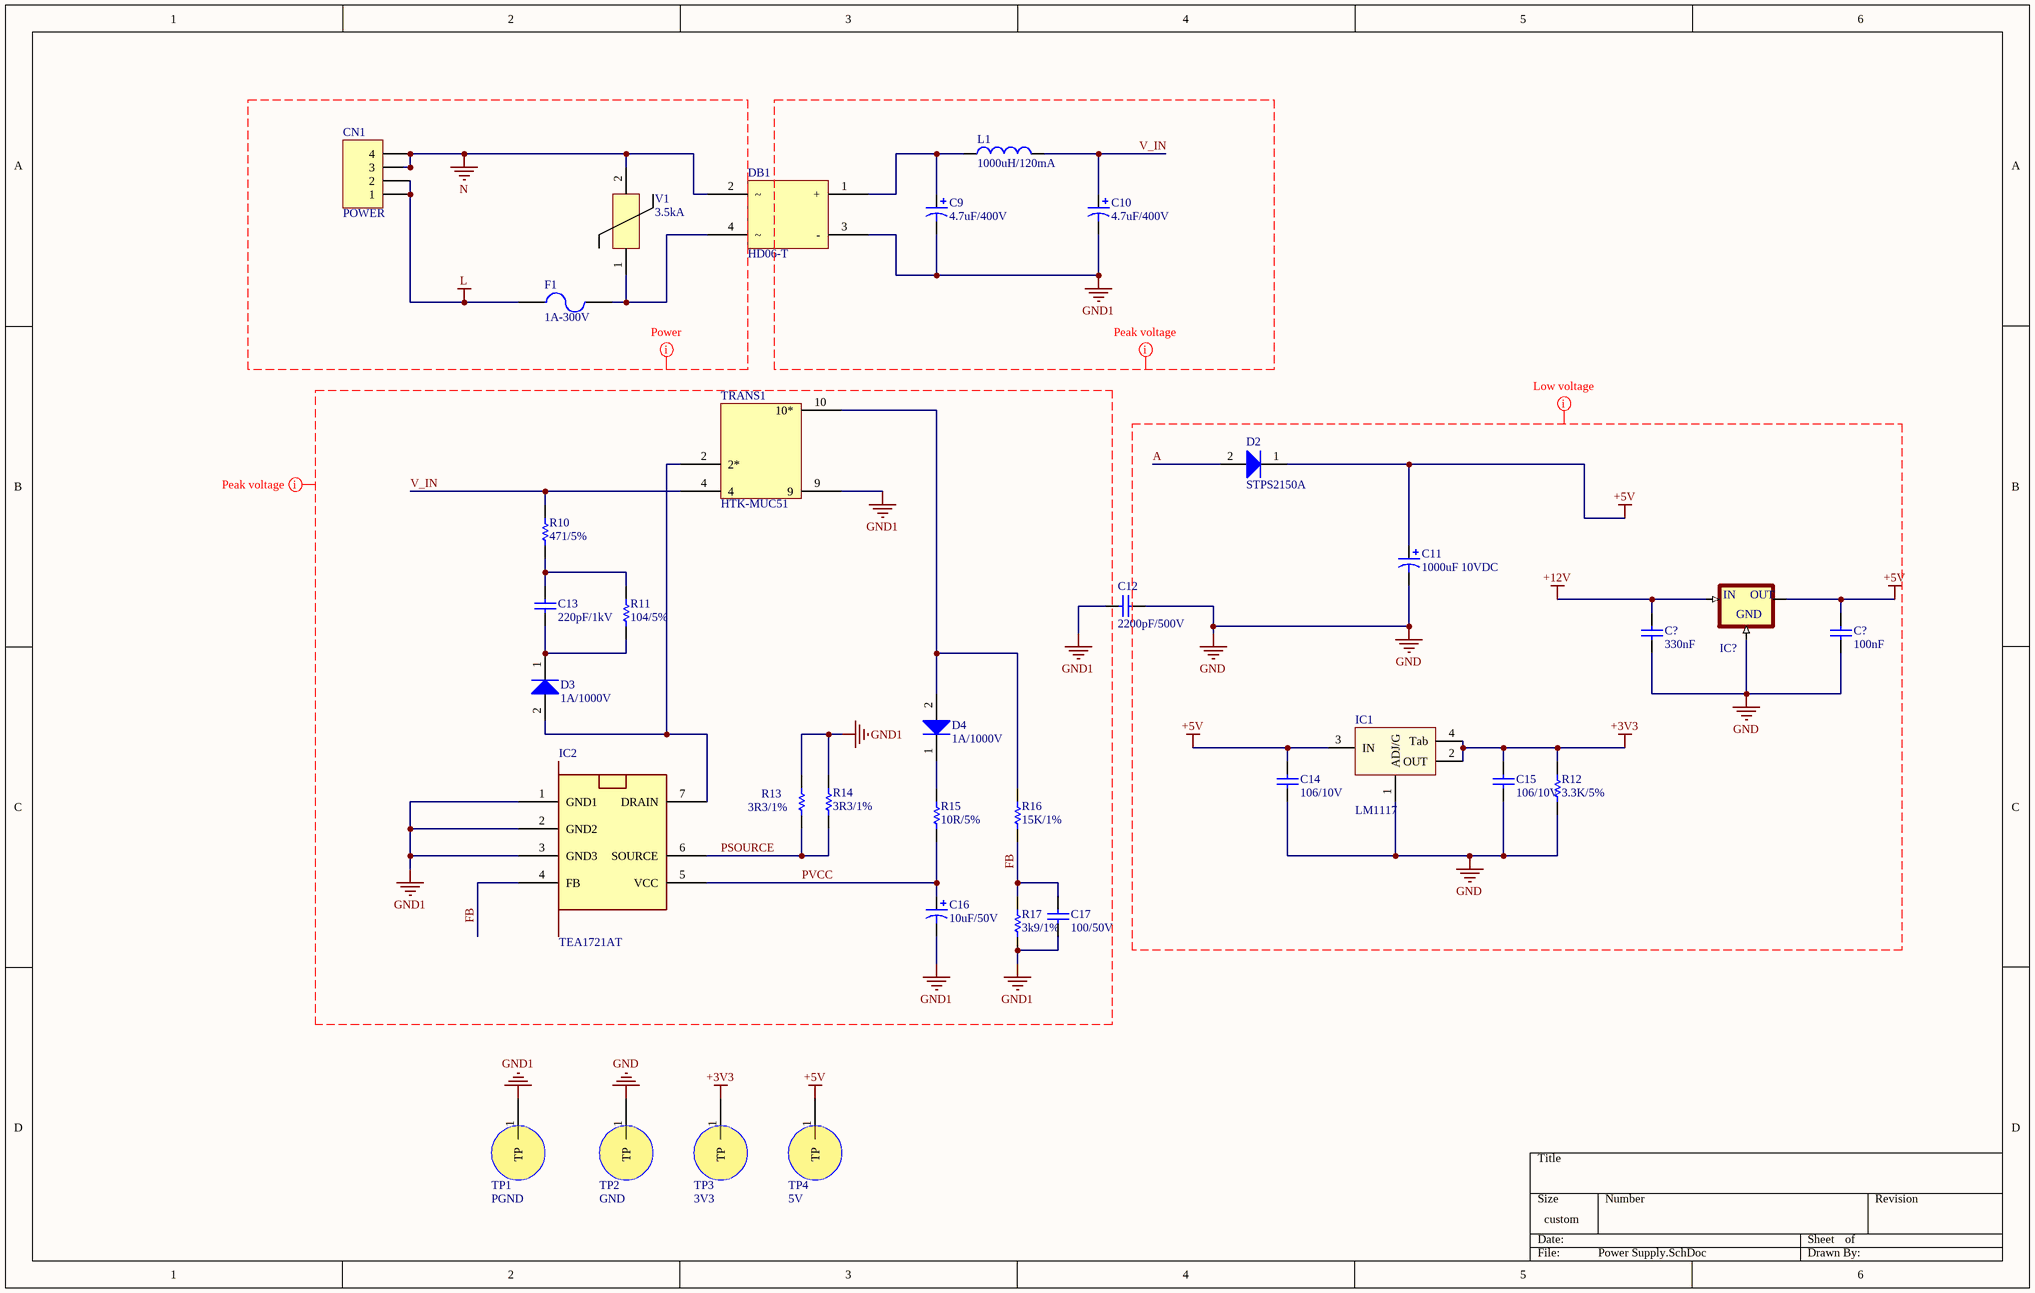
[diagram p3: Power Supply.SchDoc]

### Parts
(Parts that share a designator on the sheet are numbered #1, #2 ... from top to bottom, then left to right.)
C9  4.7uF/400V  [CAPPR3.5-8x11.5]
C10  4.7uF/400V  [CAPPR3.5-8x11.5]
C11  1000uF 10VDC  [CAPPR3.5-8x15A]
C12  2200pF/500V  [562R5TSD22]
C13  220pF/1kV  [F221K25Y5RN6UK5R]
C14  106/10V  [C0805-C]
C15  106/10V  [C0805-C]
C16  10uF/50V  [CAPPR2-5x11]
C17  100/50V  [C0603-C]
C?#1  330nF  [C0805-C]
C?#2  100nF  [C0805-C]
CN1  POWER  [H60200801000G]
D2  STPS2150A  [SMA]
D3  1A/1000V  [DO-214BA]
D4  1A/1000V  [DO-214BA]
DB1  HD06-T  [HD0X]
F1  1A-300V  [F36911000000]
IC1  LM1117  [SOT223-4N]
IC2  TEA1721AT  [SO-7]
IC?  78L05_TO252  [TO-263-3-A]  (value not drawn)
L1  1000uH/120mA  [RLB0812]
R10  471/5%  [R1206-C]
R11  104/5%  [R1206-C]
R12  3.3K/5%  [R0603-B]
R13  3R3/1%  [R1206-C]
R14  3R3/1%  [R1206-C]
R15  10R/5%  [R0603-B]
R16  15K/1%  [R0603-C]
R17  3k9/1%  [R0603-C]
TP1  PGND  [TP Multilayer]  (no BOM)
TP2  GND  [TP Multilayer]  (no BOM)
TP3  3V3  [TP Multilayer]  (no BOM)
TP4  5V  [TP Multilayer]  (no BOM)
TRANS1  HTK-MUC51  [HTK-MUC51]
V1  3.5kA  [V10E300P-H]

### Nets
+3V3: C15.2 IC1.2(OUT) IC1.4(Tab) R12.2 TP3.1(TP)
+5V: C11.1(+) C14.2 C?#2.2 D2.1(K) IC1.3(IN) IC?.3(OUT) TP4.1(TP)
+12V: C?#1.2 IC?.1(IN)
GND: C11.2(-) C12.2 C14.1 C15.1 C?#1.1 C?#2.1 IC1.1(ADJ/G) IC?.2(GND) R12.1 TP2.1(TP)
GND1: C9.2(-) C10.2(-) C12.1 C16.2(-) C17.1 DB1.3(-) IC2.1(GND1) IC2.2(GND2) IC2.3(GND3) R13.2 R14.2 R17.1 TP1.1(TP) TRANS1.9
L: CN1.1 CN1.2 F1.1
N: CN1.3 CN1.4 DB1.2 V1.2
A: D2.2(A)
FB: C17.2 IC2.4(FB) R16.1 R17.2
PSOURCE: IC2.6(SOURCE) R13.1 R14.1
PVCC: C16.1(+) IC2.5(VCC) R15.1
V_IN: C10.1(+) L1.2 R10.2 TRANS1.4
NetC9_1: C9.1(+) DB1.1(+) L1.1
NetC13_1: C13.1 D3.1(K) R11.1
NetC13_2: C13.2 R10.1 R11.2
NetD3_2: D3.2(A) IC2.7(DRAIN) TRANS1.2(2*)
NetD4_1: D4.1(K) R15.2
NetD4_2: D4.2(A) R16.2 TRANS1.10(10*)
NetDB1_4: DB1.4 F1.2 V1.1

### Layout directives
net class Peak voltage: FB, GND1, PSOURCE, PVCC, V_IN
net class Low voltage: +3V3, +5V, +12V, A, GND
net class Power: L, N

### Library data of the parts
C9 C10 = UVC2G4R7MPD: CAPP 4.7uF 400V 20%; BSH Partnumber: C-4.7-400-8x12; Manufacture: Nichicon; Pricing (USD): 0.196; Partnumber: UVC2G4R7MPD; Distributor: Mouser; Value: 4.7uF/400V; Creator: SmartDevice; Date: 20160610; ComponentLink1Description: Datasheet; ComponentLink1URL: http://www.mouser.com/ds/2/293/e-uvc-884169.pdf; Datasheet: http://www.mouser.com/ds/2/293/e-uvc-884169.pdf; ComponentLink2Description: Link sale; ComponentLink2URL: http://www.mouser.vn/ProductDetail/Nichicon/UVC2G4R7MPD/?qs=%2fha2pyFadugG8EgAuLk2FI4lDn3gTjIjspvzUlbO%2fdoUmPWf3U1vnw%3d%3d; Link sale: http://www.mouser.vn/ProductDetail/Nichicon/UVC2G4R7MPD/?qs=%2fha2pyFadugG8EgAuLk2FI4lDn3gTjIjspvzUlbO%2fdoUmPWf3U1vnw%3d%3d
C11 = EEU-FR1A102L: Aluminum Electrolytic Capacitors - Leaded 10VDC 1000uF 8x15mm LS3.5mm; BSH Partnumber: C-1000u-10V-20; Manufacture: Panasonic; Pricing (USD): 0; Partnumber: EEU-FR1A102L; Distributor: Mouser; Value: 1000uF 10VDC; Creator: NamNHc; Date: 20160709; ComponentLink1Description: Datasheet; ComponentLink1URL: http://www.mouser.com/ds/2/315/ABA0000C1021-947569.pdf; Datasheet: http://www.mouser.com/ds/2/315/ABA0000C1021-947569.pdf; ComponentLink2Description: Link sale; ComponentLink2URL: http://www.mouser.vn/ProductDetail/Panasonic/EEU-FR1A102L/?qs=sGAEpiMZZMtZ1n0r9vR22f2plZjWOZXTVY6dm5baXxU%3d; Link sale: http://www.mouser.vn/ProductDetail/Panasonic/EEU-FR1A102L/?qs=sGAEpiMZZMtZ1n0r9vR22f2plZjWOZXTVY6dm5baXxU%3d
C12 = 562R5TSD22: Ceramic Disc Capacitors 500volts 2200pF 10% .25LS X7R; BSH Partnumber: New part; Manufacture: Vishay / BC Components; Pricing (USD): 0.338; Partnumber: 562R5TSD22; Distributor: Mouser; Value: 2200pF/500V; Creator: NamNHc; Date: 20170329; ComponentLink1Description: Datasheet; ComponentLink1URL: http://www.mouser.com/ds/2/427/561r562r565r-239687.pdf; Datasheet: http://www.mouser.com/ds/2/427/561r562r565r-239687.pdf; ComponentLink2Description: Link sale; ComponentLink2URL: http://www.mouser.vn/ProductDetail/Vishay-Cera-Mite/562R5TSD22/?qs=sGAEpiMZZMt1mVBmZSXTPInczIyfF0EBuZvvR8HKRKI=; Link sale: http://www.mouser.vn/ProductDetail/Vishay-Cera-Mite/562R5TSD22/?qs=sGAEpiMZZMt1mVBmZSXTPInczIyfF0EBuZvvR8HKRKI=
C13 = F221K25Y5RN6UK5R: CAPP Ceramic Disc 220pF 1000V 10% 5x6.5mm; BSH Partnumber: C-220-1K-D; Manufacture: Vishay / BC Components; Pricing (USD): 0.129; Partnumber: F221K25Y5RN6UK5R; Distributor: Mouser; Value: 220pF/1kV; Creator: SmartDevice; Date: 20160716; ComponentLink1Description: Datasheet; ComponentLink1URL: http://www.mouser.com/ds/2/427/hvldf02-515169.pdf; Datasheet: http://www.mouser.com/ds/2/427/hvldf02-515169.pdf; ComponentLink2Description: Link sale; ComponentLink2URL: http://www.mouser.vn/ProductDetail/Vishay/F221K25Y5RN6UK5R/?qs=%2fha2pyFaduiH3AWr3oDgc4rr8ZI%252b6maFUN2U6TJgzO2VQGuikzFv0A%3d%3d; Link sale: http://www.mouser.vn/ProductDetail/Vishay/F221K25Y5RN6UK5R/?qs=%2fha2pyFaduiH3AWr3oDgc4rr8ZI%252b6maFUN2U6TJgzO2VQGuikzFv0A%3d%3d
C14 C15 = GRM21BR71A106KA73L: CAP 0805 10uF 10V 10%; BSH Partnumber: C-10u-10V-0805-10; Manufacture: Murata Electronics; Pricing (USD): 0.039; Partnumber: GRM21BR71A106KA73L; Distributor: Mouser; Value: 106/10V; Creator: SmartDevice; Date: 20160715; ComponentLink1Description: Datasheet; ComponentLink1URL: http://www.murata.com/products/catalog/pdf/c02e.pdf; Datasheet: http://www.murata.com/products/catalog/pdf/c02e.pdf; ComponentLink2Description: Link sale; ComponentLink2URL: http://www.mouser.vn/ProductDetail/Murata/GRM21BR71A106KA73L/?qs=%2fha2pyFaduh%2fEdsyu96AxlYmpb%2fkUgcA5NhpACNM6PnXP0Re01zvkhFjHxs1cDT4; Link sale: http://www.mouser.vn/ProductDetail/Murata/GRM21BR71A106KA73L/?qs=%2fha2pyFaduh%2fEdsyu96AxlYmpb%2fkUgcA5NhpACNM6PnXP0Re01zvkhFjHxs1cDT4
C16 = EEU-EB1H100S: CAPP 10uF 50V 20%; BSH Partnumber: C-10u-50-20-D; Manufacture: Panasonic; Pricing (USD): 0.072; Partnumber: EEU-EB1H100S; Distributor: Mouser; Value: 10uF/50V; Creator: SmartDevice; Date: 20160716; ComponentLink1Description: Datasheet; ComponentLink1URL: http://www.mouser.com/ds/2/315/DMF0000COL62-951366.pdf; Datasheet: http://www.mouser.com/ds/2/315/DMF0000COL62-951366.pdf; ComponentLink2Description: Link sale; ComponentLink2URL: http://www.mouser.vn/ProductDetail/Panasonic/EEU-EB1H100S/?qs=sGAEpiMZZMtZ1n0r9vR22RyzzjEKRzqKZbIP%252bqQ6oFI%3d; Link sale: http://www.mouser.vn/ProductDetail/Panasonic/EEU-EB1H100S/?qs=sGAEpiMZZMtZ1n0r9vR22RyzzjEKRzqKZbIP%252bqQ6oFI%3d
C17 = GRM1885C1H100JA01D: CAP 0603 10pF 5% 50V; BSH Partnumber: C-100-50-0603-5; Manufacture: Murata Electronics; Pricing (USD): 0.01; Partnumber: GRM1885C1H100JA01D; Distributor: Mouser; Value: 100/50V; Creator: SmartDevice; Date: 20160715; ComponentLink1Description: Datasheet; ComponentLink1URL: http://www.murata.com/products/catalog/pdf/c02e.pdf; Datasheet: http://www.murata.com/products/catalog/pdf/c02e.pdf; ComponentLink2Description: Link sale; ComponentLink2URL: http://www.mouser.vn/ProductDetail/Murata/GRM1885C1H100JA01D/?qs=%2fha2pyFadug%2fvrC4VCXnlbJmrOFMaxj30QUgA6YXUVlxuM%2fhvX8xlA%3d%3d; Link sale: http://www.mouser.vn/ProductDetail/Murata/GRM1885C1H100JA01D/?qs=%2fha2pyFadug%2fvrC4VCXnlbJmrOFMaxj30QUgA6YXUVlxuM%2fhvX8xlA%3d%3d
C?#1 C?#2 = GRM21BR71A106KA73L: CAP 0805 10uF 10V 10%; BSH Partnumber: C-10u-10V-0805-10; Manufacture: Murata Electronics; Value: 106/10V; Pricing (USD): 0.039; Partnumber: GRM21BR71A106KA73L; Distributor: Mouser; Creator: SmartDevice; Date: 20160715; ComponentLink1Description: Datasheet; ComponentLink1URL: http://www.murata.com/products/catalog/pdf/c02e.pdf; Datasheet: http://www.murata.com/products/catalog/pdf/c02e.pdf; ComponentLink2Description: Link sale; ComponentLink2URL: http://www.mouser.vn/ProductDetail/Murata/GRM21BR71A106KA73L/?qs=%2fha2pyFaduh%2fEdsyu96AxlYmpb%2fkUgcA5NhpACNM6PnXP0Re01zvkhFjHxs1cDT4; Link sale: http://www.mouser.vn/ProductDetail/Murata/GRM21BR71A106KA73L/?qs=%2fha2pyFaduh%2fEdsyu96AxlYmpb%2fkUgcA5NhpACNM6PnXP0Re01zvkhFjHxs1cDT4
CN1 = H60200801000G: CON H60200801000G 4P Male; BSH Partnumber: CN-H60200801000G; Manufacture: ANYTEK; Value: CON-4; Partnumber: H60200801000G; Creator: SmartDevice; Date: 20160715; ComponentLink1Description: Datasheet; ComponentLink1URL: http://www.anytek.com.tw/UserUpFiles/20120827/QEmQqqk9rR3n.pdf; Datasheet: http://www.anytek.com.tw/UserUpFiles/20120827/QEmQqqk9rR3n.pdf; ComponentLink2Description: Link sale; ComponentLink2URL: http://www.anytek.com.tw/EN/search_product.aspx?cateid=&codename=&exflag1=0&exflag5=60200801000G&page=1; Link sale: http://www.anytek.com.tw/EN/search_product.aspx?cateid=&codename=&exflag1=0&exflag5=60200801000G&page=1
D2 = STPS2150A: DIODE SMA 2.0A 150V 2.95x4.6x2.03mm; BSH Partnumber: D-STPS2150A; Manufacture: STMicroelectronics; Pricing (USD): 0.155; Partnumber: STPS2150A; Distributor: Mouser; Value: STPS2150A; Creator: SmartDevice; Date: 20160610; ComponentLink1Description: Datasheet; ComponentLink1URL: http://www.mouser.com/ds/2/389/CD00003322-250509.pdf; Datasheet: http://www.mouser.com/ds/2/389/CD00003322-250509.pdf; ComponentLink2Description: Link sale; ComponentLink2URL: http://www.mouser.vn/ProductDetail/STMicroelectronics/STPS2150A/?qs=%2fha2pyFadugOUJO7vR3gGVErv5AK1AyP3XR3TiacJmw%3d; Link sale: http://www.mouser.vn/ProductDetail/STMicroelectronics/STPS2150A/?qs=%2fha2pyFadugOUJO7vR3gGVErv5AK1AyP3XR3TiacJmw%3d
D3 D4 = GF1M-E3/67A: DIODE DO-214AB 1000V 1A; BSH Partnumber: D-GF1M; Manufacture: Vishay Semiconductors; Pricing (USD): 0.187; Partnumber: GF1M-E3/67A; Distributor: Mouser; Value: 1A/1000V; Creator: SmartDevice; Date: 20151022; ComponentLink1Description: Datasheet; ComponentLink1URL: http://www.mouser.com/ds/2/427/gf1-240444.pdf; Datasheet: http://www.mouser.com/ds/2/427/gf1-240444.pdf; ComponentLink2Description: Link sale; ComponentLink2URL: http://vn.mouser.com/ProductDetail/Vishay-Semiconductors/GF1M-E3-67A/?qs=AvlKB63p5SmLpodxku2zLQ%3D%3D; Link sale: http://vn.mouser.com/ProductDetail/Vishay-Semiconductors/GF1M-E3-67A/?qs=AvlKB63p5SmLpodxku2zLQ%3D%3D
DB1 = HD06-T: DB SMD 0.8A 600V; BSH Partnumber: D-HD06-T; Manufacture: Diodes Incorporated; Pricing (USD): 0.151; Partnumber: HD06-T; Distributor: Mouser; Value: HD06-T; Creator: SmartDevice; Date: 20160704; ComponentLink1Description: Datasheet; ComponentLink1URL: http://www.mouser.com/ds/2/115/ds17003-38038.pdf; Datasheet: http://www.mouser.com/ds/2/115/ds17003-38038.pdf; ComponentLink2Description: Link sale; ComponentLink2URL: http://www.mouser.vn/ProductDetail/Diodes-Incorporated/HD06-T/?qs=sGAEpiMZZMtQ8nqTKtFS%2fNgL6ac11fJuElzuDV0ZOyo%3d; Link sale: http://www.mouser.vn/ProductDetail/Diodes-Incorporated/HD06-T/?qs=sGAEpiMZZMtQ8nqTKtFS%2fNgL6ac11fJuElzuDV0ZOyo%3d
F1 = 36911000000: FUSE 36911000000 1A 300V 4x8mm; BSH Partnumber: F-1A-300V; Manufacture: Little Fuse; Pricing (USD): 0.212; Partnumber: 36911000000; Distributor: Mouser; Value: 1A-300V; Creator: SmartDevice; Date: 20160611; ComponentLink1Description: Datasheet; ComponentLink1URL: http://www.mouser.com/ds/2/240/Littelfuse_Fuse_369_Datasheet.pdf-693406.pdf; Datasheet: http://www.mouser.com/ds/2/240/Littelfuse_Fuse_369_Datasheet.pdf-693406.pdf; ComponentLink2Description: Link sale; ComponentLink2URL: http://www.mouser.vn/ProductDetail/Littelfuse/36911000000/?qs=%2fha2pyFadugel56iQkHFpKBlKzqe72eQ8PsAjO18UxxK9Xd8%252bW4Qpg%3d%3d; Link sale: http://www.mouser.vn/ProductDetail/Littelfuse/36911000000/?qs=%2fha2pyFadugel56iQkHFpKBlKzqe72eQ8PsAjO18UxxK9Xd8%252bW4Qpg%3d%3d
IC1 = LM1117: 3v3; Value: LM317
IC2 = TEA1721AT/N1,118: IC AC/DC Converter SO-7 5.0x6.2x1.75mm; BSH Partnumber: IC-TEA1721AT/N1,118; Manufacture: NXP; Pricing (USD): 1; Partnumber: TEA1721AT/N1,118; Distributor: Mouser; Value: TEA1721AT; Creator: SmartDevice; Date: 20160611; ComponentLink1Description: Datasheet; ComponentLink1URL: http://www.mouser.com/ds/2/302/TEA1721AT-843077.pdf; Datasheet: http://www.mouser.com/ds/2/302/TEA1721AT-843077.pdf; ComponentLink2Description: Link sale; ComponentLink2URL: http://www.mouser.vn/ProductDetail/NXP/TEA1721AT-N1118/?qs=%2fha2pyFadujS%2fIwLEty%2falDzm3J8%2fJUNkB0iVdfNz8M%3d; Link sale: http://www.mouser.vn/ProductDetail/NXP/TEA1721AT-N1118/?qs=%2fha2pyFadujS%2fIwLEty%2falDzm3J8%2fJUNkB0iVdfNz8M%3d
IC? = 78L05_TO252: 78L05
L1 = RLB0812-102KL: IND  1000uH 10% 0.12A; BSH Partnumber: L-RLB0812-102KL; Manufacture: Bourns; Pricing (USD): 0.116; Partnumber: RLB0812-102KL; Distributor: Mouser; Value: 1000uH/120mA; Creator: SmartDevice; Date: 20160707; ComponentLink1Description: Datasheet; ComponentLink1URL: http://www.mouser.com/ds/2/54/LB-777833.pdf; Datasheet: http://www.mouser.com/ds/2/54/LB-777833.pdf; ComponentLink2Description: Link sale; ComponentLink2URL: http://www.mouser.vn/ProductDetail/Bourns/RLB0812-102KL/?qs=%2fha2pyFadugUXycZP3hAKbNHRNMcV3vYTNoRX6lu328P8PrVdgjsIA%3d%3d; Link sale: http://www.mouser.vn/ProductDetail/Bourns/RLB0812-102KL/?qs=%2fha2pyFadugUXycZP3hAKbNHRNMcV3vYTNoRX6lu328P8PrVdgjsIA%3d%3d
R10 = RC1206JR-07470RL: RES 1206 470R 5% 250mW; BSH Partnumber: R-470R-1206-5; Manufacture: Yageo; Pricing (USD): 0.004; Partnumber: RC1206JR-07470RL; Distributor: Mouser; Value: 471/5%; Creator: SmartDevice; Date: 20160716; ComponentLink1Description: Datasheet; ComponentLink1URL: http://www.mouser.com/ds/2/447/PYu-RC1206_51_RoHS_L-4-349080.pdf; Datasheet: http://www.mouser.com/ds/2/447/PYu-RC1206_51_RoHS_L-4-349080.pdf; ComponentLink2Description: Link sale; ComponentLink2URL: http://www.mouser.vn/ProductDetail/Yageo/RC1206JR-07470RL/?qs=%2fha2pyFadugAv10W5eASAinpIUt6qtrVv1pLdKpZoto0rQMznlyYjg%3d%3d; Link sale: http://www.mouser.vn/ProductDetail/Yageo/RC1206JR-07470RL/?qs=%2fha2pyFadugAv10W5eASAinpIUt6qtrVv1pLdKpZoto0rQMznlyYjg%3d%3d
R11 = RC1206JR-07100KL: RES 1206 100K 5% 250mW; BSH Partnumber: R-100K-1206-5; Manufacture: Yageo; Pricing (USD): 0.004; Partnumber: RC1206JR-07100KL; Distributor: Mouser; Value: 104/5%; Creator: SmartDevice; Date: 20160716; ComponentLink1Description: Datasheet; ComponentLink1URL: http://www.mouser.com/ds/2/447/PYu-RC1206_51_RoHS_L-4-349080.pdf; Datasheet: http://www.mouser.com/ds/2/447/PYu-RC1206_51_RoHS_L-4-349080.pdf; ComponentLink2Description: Link sale; ComponentLink2URL: http://www.mouser.vn/ProductDetail/Yageo/RC1206JR-07100KL/?qs=%2fha2pyFadugAv10W5eASAgAbIwDj0mC5zdBHJsZxIFkHK6MBmZ2tew%3d%3d; Link sale: http://www.mouser.vn/ProductDetail/Yageo/RC1206JR-07100KL/?qs=%2fha2pyFadugAv10W5eASAgAbIwDj0mC5zdBHJsZxIFkHK6MBmZ2tew%3d%3d
R12 = RC0603JR-073K3L: RES 0603 3.3K 5% 100mW; BSH Partnumber: R-3K3-0603-5; Manufacture: Yageo; Pricing (USD): 0.002; Partnumber: RC0603JR-073K3L; Distributor: Mouser; Value: 3.3K/5%; Creator: SmartDevice; Date: 20160716; ComponentLink1Description: Datasheet; ComponentLink1URL: http://www.mouser.com/ds/2/447/RC0603-272842.pdf; Datasheet: http://www.mouser.com/ds/2/447/RC0603-272842.pdf; ComponentLink2Description: Link sale; ComponentLink2URL: http://www.mouser.vn/ProductDetail/Yageo/RC0603JR-073K3L/?qs=%2fha2pyFaduiI%252b%2f%2fp%2fYhTTUC9G%2ftM89tiss13Vr5bentGgwH5efyYUg%3d%3d; Link sale: http://www.mouser.vn/ProductDetail/Yageo/RC0603JR-073K3L/?qs=%2fha2pyFaduiI%252b%2f%2fp%2fYhTTUC9G%2ftM89tiss13Vr5bentGgwH5efyYUg%3d%3d
R13 R14 = RC1206FR-073R3L: RES 1206 3R3 1% 250mW; BSH Partnumber: R-3R3-1206-1; Manufacture: Yageo; Pricing (USD): 0.009; Partnumber: RC1206FR-073R3L; Distributor: Mouser; Value: 3R3/1%; Creator: SmartDevice; Date: 20160716; ComponentLink1Description: Datasheet; ComponentLink1URL: http://www.mouser.com/ds/2/447/PYu-RC1206_51_RoHS_L-4-349080.pdf; Datasheet: http://www.mouser.com/ds/2/447/PYu-RC1206_51_RoHS_L-4-349080.pdf; ComponentLink2Description: Link sale; ComponentLink2URL: http://www.mouser.vn/ProductDetail/Yageo/RC1206FR-073R3L/?qs=%2fha2pyFaduhRUg1%252bSfBETOq42wV2vAUJY3MnS0bXa6FiCpwrrcH8OQ%3d%3d; Link sale: http://www.mouser.vn/ProductDetail/Yageo/RC1206FR-073R3L/?qs=%2fha2pyFaduhRUg1%252bSfBETOq42wV2vAUJY3MnS0bXa6FiCpwrrcH8OQ%3d%3d
R15 = RC0603JR-0710RL: RES 0603 10R 5% 100mW; BSH Partnumber: R-10R-0603-5; Manufacture: Yageo; Pricing (USD): 0.002; Partnumber: RC0603JR-0710RL; Distributor: Mouser; Value: 10R/5%; Creator: SmartDevice; Date: 20150818; ComponentLink1Description: Datasheet; ComponentLink1URL: http://www.mouser.com/ds/2/447/RC0603-272842.pdf; Datasheet: http://www.mouser.com/ds/2/447/RC0603-272842.pdf; ComponentLink2Description: Link sale; ComponentLink2URL: http://vn.mouser.com/ProductDetail/Yageo/RC0603JR-0710RL/?qs=sGAEpiMZZMu61qfTUdNhG5eFuApKbqVd7N2n6WR6Q2s%3d; Link sale: http://vn.mouser.com/ProductDetail/Yageo/RC0603JR-0710RL/?qs=sGAEpiMZZMu61qfTUdNhG5eFuApKbqVd7N2n6WR6Q2s%3d
R16 = RC0603FR-0715KL: RES 0603 15k 1% 100mW; BSH Partnumber: R-15K-0603-1; Manufacture: Yageo; Pricing (USD): 0.002; Partnumber: RC0603FR-0715KL; Distributor: Mouser; Value: 15K/1%; Creator: SmartDevice; Date: 20160716; ComponentLink1Description: Datasheet; ComponentLink1URL: http://www.mouser.com/ds/2/447/RC0603-272842.pdf; Datasheet: http://www.mouser.com/ds/2/447/RC0603-272842.pdf; ComponentLink2Description: Link sale; ComponentLink2URL: http://www.mouser.vn/ProductDetail/Yageo/RC0603FR-0715KL/?qs=%2fha2pyFaduhXXNW8qwNUNlRLrWlOrSb86bYDLRXgp06KHZvTB0LjtA%3d%3d; Link sale: http://www.mouser.vn/ProductDetail/Yageo/RC0603FR-0715KL/?qs=%2fha2pyFaduhXXNW8qwNUNlRLrWlOrSb86bYDLRXgp06KHZvTB0LjtA%3d%3d
R17 = RC0603FR-073K9L: RES 0603 3K9 1% 100mW; BSH Partnumber: R-3K9-0603-1; Manufacture: Yageo; Pricing (USD): 0.0013; Partnumber: RC0603FR-073K9L; Distributor: Digikey; Value: 3k9/1%; Creator: SmartDevice; Date: 20160714; ComponentLink1Description: Datasheet; ComponentLink1URL: http://www.yageo.com.tw/exep/pages/download/literatures/PYu-R_INT-thick_7.pdf; Datasheet: http://www.yageo.com.tw/exep/pages/download/literatures/PYu-R_INT-thick_7.pdf; ComponentLink2Description: Link sale; ComponentLink2URL: http://www.digikey.com/product-detail/en/yageo/RC0603FR-073K9L/311-3.90KHRTR-ND/727136; Link sale: http://www.digikey.com/product-detail/en/yageo/RC0603FR-073K9L/311-3.90KHRTR-ND/727136
TP1-TP4 = TP1: Test Point Multilayer; Partnumber: TP1; Value: TP Multilayer; BSH Partnumber: TP; Creator: DucNTc; Date: 20150912; ComponentLink1Description: Datasheet; ComponentLink2Description: Link sale
TRANS1 = HTK-MUC51: Transformer 5V/1A Power; BSH Partnumber: T-HTK-MUC51; Manufacture: Tabuchi electric; Value: TRANS; Pricing (USD): 2; Partnumber: HTK-MUC51; Distributor: Tabuchi Viet Nam; Creator: NamNHc; Date: 20160614; ComponentLink1Description: Datasheet; ComponentLink2Description: Link sale
V1 = V10E300P: Varistors 300V 10mm Epoxy UltraMOV; BSH Partnumber: New part; Manufacture: Little Fuse; Pricing (USD): 0.161; Partnumber: V10E300P; Distributor: Mouser; Value: 3.5kA; Creator: NamNHc; Date: 20170329; ComponentLink1Description: Datasheet; ComponentLink1URL: http://www.mouser.com/ds/2/240/Littelfuse_MOV_UltraMOV-67928.pdf; Datasheet: http://www.mouser.com/ds/2/240/Littelfuse_MOV_UltraMOV-67928.pdf; ComponentLink2Description: Link sale; ComponentLink2URL: http://www.mouser.vn/ProductDetail/Littelfuse/V10E300P/?qs=sGAEpiMZZMuQmL5N8IqpX830%2f%252b2kYIgxyGDqkDiNBrs%3d; Link sale: http://www.mouser.vn/ProductDetail/Littelfuse/V10E300P/?qs=sGAEpiMZZMuQmL5N8IqpX830%2f%252b2kYIgxyGDqkDiNBrs%3d

## Sheet External Flash.SchDoc
size A
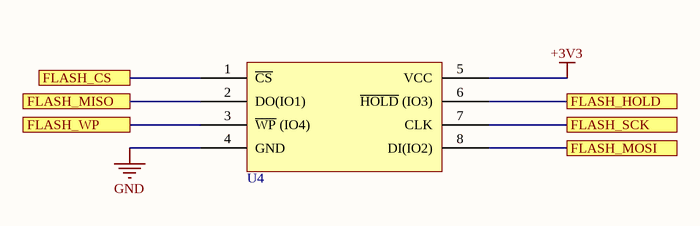
[diagram p4: External Flash.SchDoc]

### Parts
U4  W25Q128  [SOIC-8]  (value not drawn)

### Ports
FLASH_CS, FLASH_HOLD, FLASH_MISO, FLASH_MOSI, FLASH_SCK, FLASH_WP

### Nets
+3V3: U4.5(VCC)
GND: U4.4(GND)
SPI3_CS0: U4.1(~{CS}) ; port FLASH_CS
SPI3_MISO: U4.2(DO(IO1)) ; port FLASH_MISO
SPI3_MOSI: U4.8(DI(IO2)) ; port FLASH_MOSI
SPI3_SCLK: U4.7(CLK) ; port FLASH_SCK
NetU4_3: U4.3(~{WP}_(IO4)) ; port FLASH_WP
NetU4_6: U4.6(~{HOLD}_(IO3)) ; port FLASH_HOLD

### Library data of the parts
U4 = W25Q128: 3V 128M-BIT / SERIAL FLASH MEMORY WITH / DUAL/QUAD SP

## Nets that join several sheets
+3V3: MCU (6 pins), Ethernet (9 pins), Power Supply (5 pins), External Flash (U4.5)
+5V: MCU (11 pins), Power Supply (7 pins)
GND: MCU (20 pins), Ethernet (27 pins), Power Supply (10 pins), External Flash (U4.4)
NetU2_11: MCU (U2.11), Ethernet (U3.36)
RSTn: MCU (U2.12), Ethernet (U3.37)
SPI2_CS0: MCU (U2.23), Ethernet (U3.32)
SPI2_MISO: MCU (U2.14), Ethernet (U3.34)
SPI2_MOSI: MCU (U2.16), Ethernet (U3.35)
SPI2_SCLK: MCU (U2.13), Ethernet (U3.33)
SPI3_CS0: MCU (U2.29), External Flash (U4.1)
SPI3_MISO: MCU (U2.31), External Flash (U4.2)
SPI3_MOSI: MCU (U2.37), External Flash (U4.8)
SPI3_SCLK: MCU (U2.30), External Flash (U4.7)